# Altium schematic sheet POWER.SchDoc
size A3; SheetNumber: 4; SheetTotal: 5
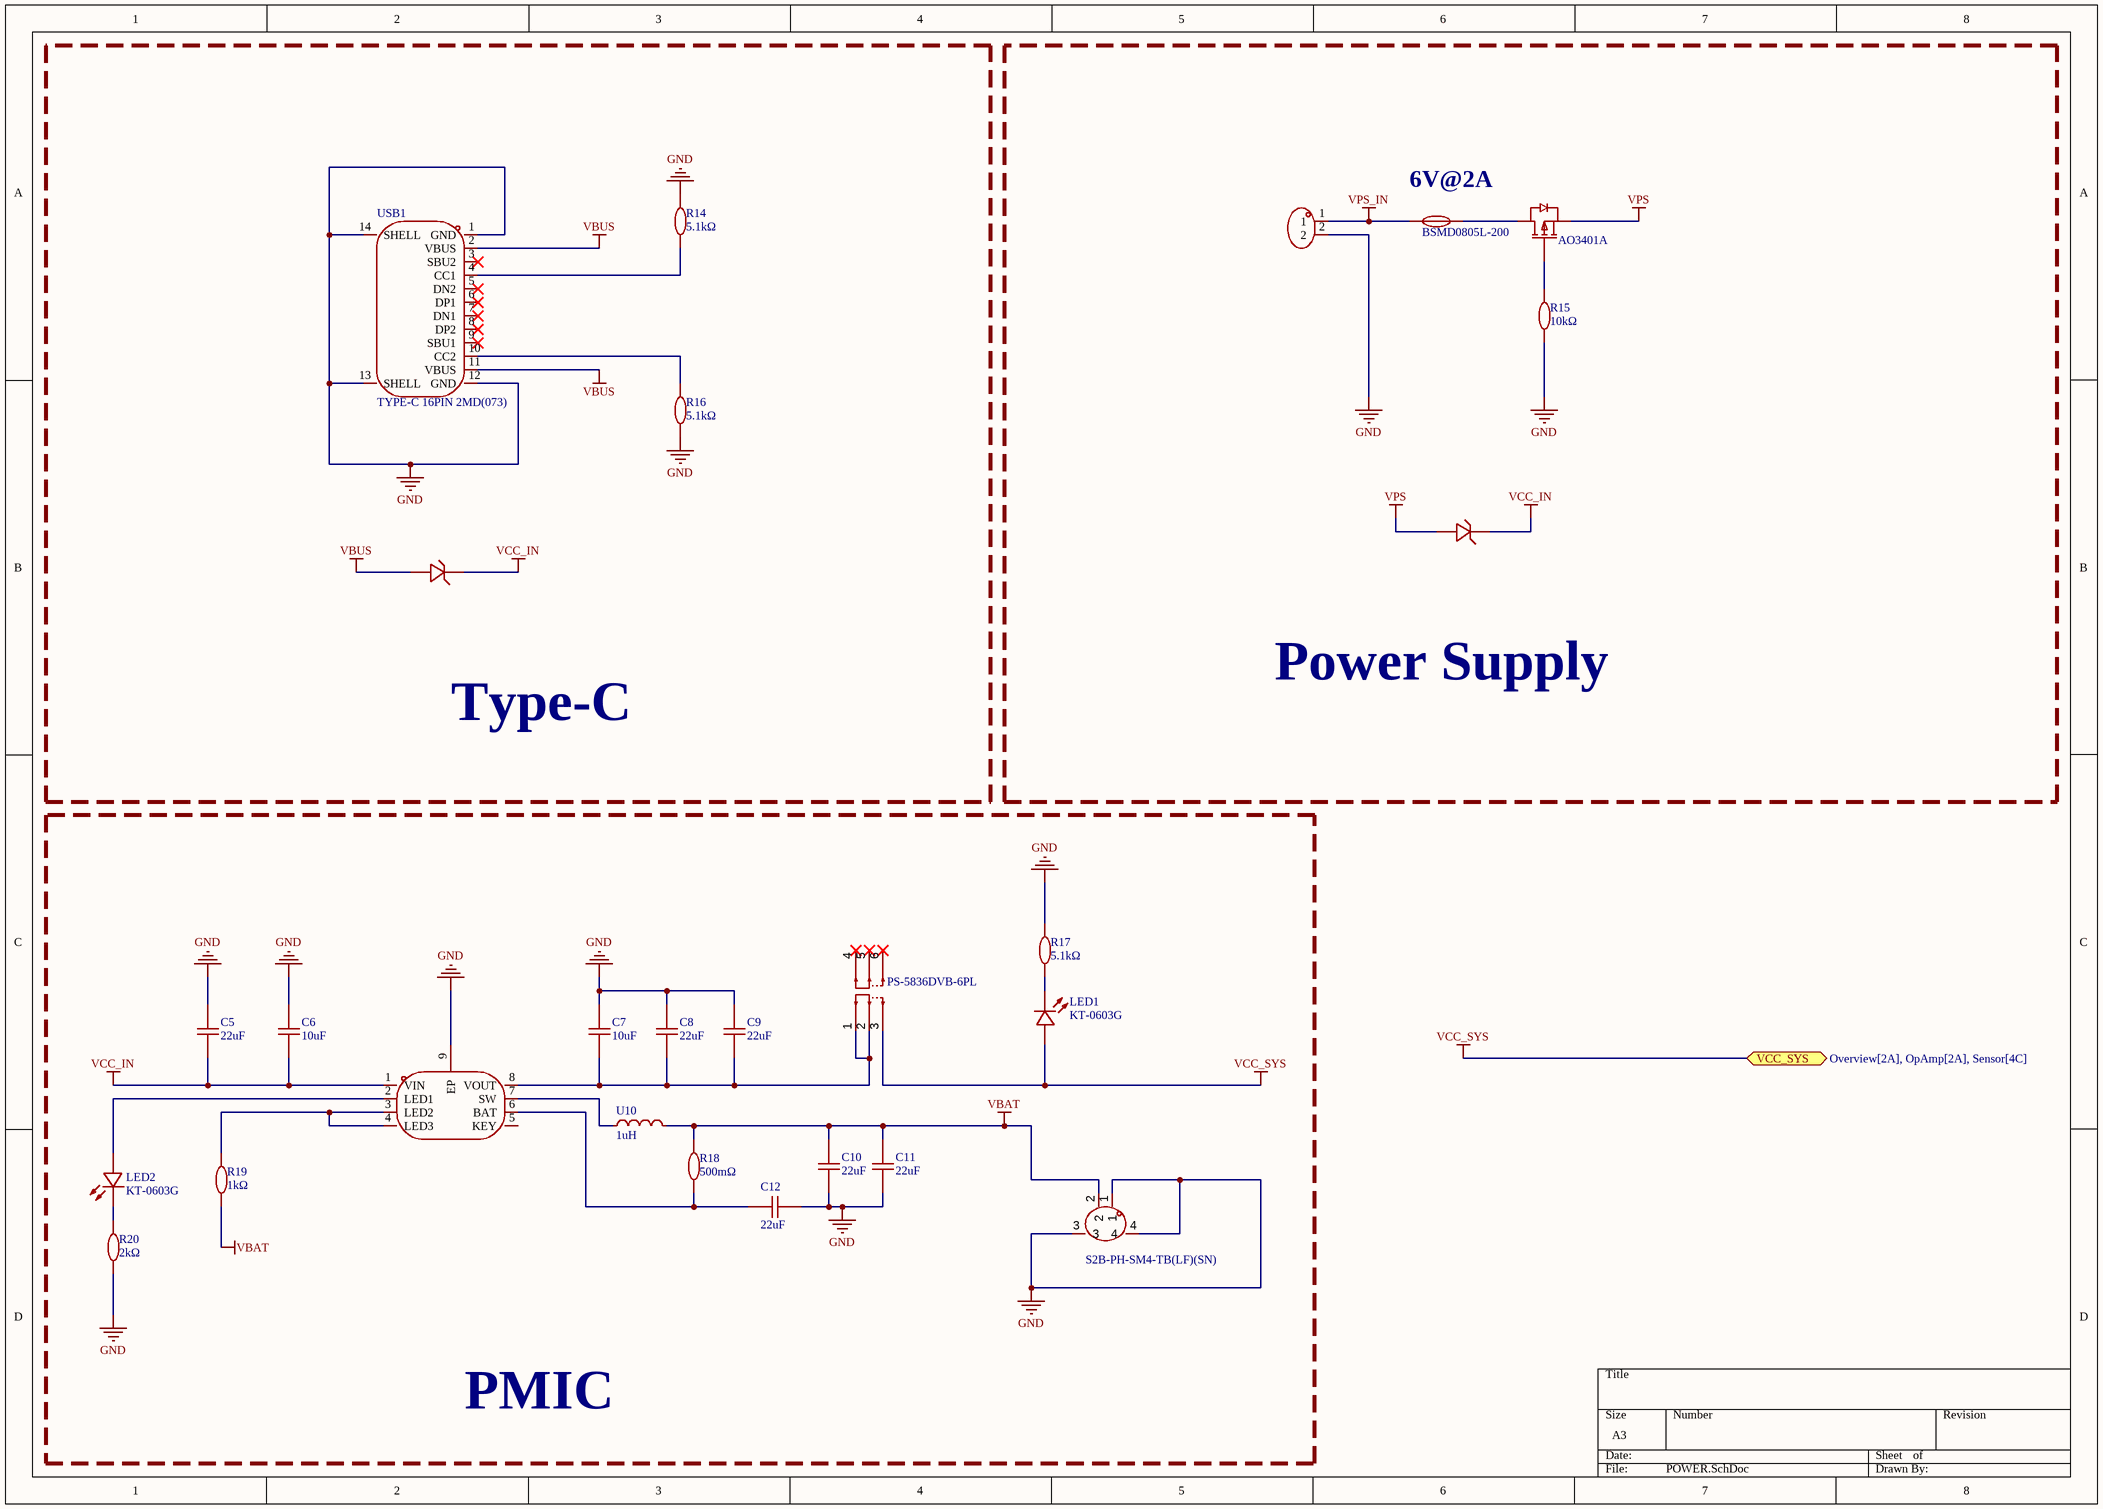
[diagram p0: POWER.SchDoc]

## Parts
C5  22uF  [C0603]
C6  10uF  [C0603]
C7  10uF  [C0603]
C8  22uF  [C0603]
C9  22uF  [C0603]
C10  22uF  [C0603]
C11  22uF  [C0603]
C12  22uF  [C0603]
CN1  S2B-PH-SM4-TB(LF)(SN)  [CONN-SMD_P2.00_S2B-PH-SM4-TB-LF-SN]
D1  DSK24  [SOD-123FL_L2.7-W1.8-LS3.8-RD]  (value not drawn)
D2  DSK24  [SOD-123FL_L2.7-W1.8-LS3.8-RD]  (value not drawn)
F1  BSMD0805L-200  [F0805]
LED1  KT-0603G  [LED0603-GR]
LED2  KT-0603G  [LED0603-GR]
Q3  AO3401A  [SOT-23_L2.9-W1.3-P1.90-LS2.4-BR]
R14  5.1kΩ  [R0402]
R15  10kΩ  [R0402]
R16  5.1kΩ  [R0402]
R17  5.1kΩ  [R0402]
R18  500mΩ  [R0402]
R19  1kΩ  [R0402]
R20  2kΩ  [R0402]
U9  PS-5836DVB-6PL  [SW-TH_6P-L5.8-W5.8-P2.00-LS4.5-BL]
U10  1uH  [IND-SMD_L2.5-W2.0_WPN252012H]
U11  IP5306  [ESOP-8_L4.9-W3.9-P1.27-LS6.0-BL-EP]  (value not drawn)
U?  HX PZ2.54-1x2P ZZ  [HDR-TH_2P-P2.54-V-M-3]  (value not drawn)
USB1  TYPE-C 16PIN 2MD(073)  [USB-C-SMD_TYPE-C-6PIN-2MD-073]

## Blocks framed on the sheet
Type-C: D2 R14 R16 USB1
Power Supply: D1 F1 Q3 R15 U?
PMIC: C5-C12 CN1 LED1 LED2 R17-R20 U9-U11

## Ports
VCC_SYS (bidir, see Overview[2A], OpAmp[2A], Sensor[4C])

## Nets
GND: C5.2 C6.2 C7.2 C8.2 C9.2 C10.1 C11.1 C12.1 CN1.1 CN1.3 CN1.4 R14.2 R15.1 R16.1 R17.2 R20.1 U11.9(EP) U?.2 USB1.1(GND) USB1.12(GND) USB1.13(SHELL) USB1.14(SHELL)
VBAT: C10.2 C11.2 CN1.2 R18.2 R19.1 U10.2
VBUS: D2.2(A) USB1.2(VBUS) USB1.11(VBUS)
VCC_IN: C5.1 C6.1 D1.1(C) D2.1(C) U11.1(VIN)
VCC_SYS: LED1.2(A) U9.3 ; port VCC_SYS
VPS: D1.2(A) Q3.2(S)
VPS_IN: F1.1 U?.1
NetC7_1: C7.1 C8.1 C9.1 U9.1 U9.2 U11.8(VOUT)
NetC12_2: C12.2 R18.1 U11.6(BAT)
NetF1_2: F1.2 Q3.3(D)
NetLED1_1: LED1.1(K) R17.1
NetLED2_1: LED2.1(K) R20.2
NetLED2_2: LED2.2(A) U11.2(LED1)
NetQ3_1: Q3.1(G) R15.2
NetR14_1: R14.1 USB1.4(CC1)
NetR16_2: R16.2 USB1.10(CC2)
NetR19_2: R19.2 U11.3(LED2) U11.4(LED3)
NetU10_1: U10.1 U11.7(SW)

Not connected (* = marked no-connect by the designer): U9 4* 5* 6*; U11 5(KEY); USB1 3(SBU2)* 5(DN2)* 6(DP1)* 7(DN1)* 8(DP2)* 9(SBU1)*

## Notes on the sheet
- (near F1) 6V@2A

## Library data of the parts
C5 C8-C12 = 22uF: 16V 22uF X5R ±20% 0603 Ceramic Capacitors ROHS
C6 C7 = 10uF: 10V 10uF X5R ±10% 0603 Ceramic Capacitors ROHS
CN1 = S2B-PH-SM4-TB(LF)(SN): 1x2P 间距:2mm 卧贴 系列:PH; Symbol: S2B-PH-SM4-TB(LF)(SN)
D1 D2 = DSK24: 电压:40V 电流:2A; Manufacturer: Littelfuse(美国力特); Manufacturer Part: SMAJ5.0A; Symbol: SMAJ5.0A-C83329; Device: SMAJ5.0A_C83329; Add into BOM: yes; Polarity: Unidirectional; Reverse Stand-Off Voltage (Vrwm): 5V; Clamping Voltage: 9.2V; Peak Pulse Current (Ipp): 43.5A; Peak Pulse Power Dissipation (Ppp): 400W; Voltage - Breakdown: 6.4V; Reverse Leakage Current (Ir): 800uA; Type: TVS; LCSC Part Name: 耐压/V 5V-440V 峰值脉冲功率 400W; Supplier Part: C83329; Supplier Footprint: DO-214AC(SMA); JLCPCB Part Class: Extended Part; Datasheet: https://item.szlcsc.com/datasheet/SMAJ5.0A/84493.html; Supplier: LCSC; Convert to PCB: yes; Operating Temperature: -65℃~+150℃
F1 = BSMD0805L-200: 6V 2A 0805自恢复; Symbol: BSMD0805L-200
LED1 LED2 = KT-0603G: Green 0603 LED Indication - Discrete ROHS
Q3 = AO3401A: 1个P沟道 耐压:30V 电流:4A; Symbol: AO3401A
R14 R16 R17 = 5.1kΩ: 5.1kΩ 62.5mW 50V ±100ppm/℃ Thick Film Resistor ±1% 0402 Chip Resistor - Surface Mount ROHS
R15 = 10kΩ: 62.5mW 10kΩ 50V ±100ppm/℃ Thick Film Resistor ±1% 0402 Chip Resistor - Surface Mount ROHS
R18 R19 = 1kΩ: 1kΩ 62.5mW 50V ±100ppm/℃ Thick Film Resistor ±1% 0402 Chip Resistor - Surface Mount ROHS
R20 = 2kΩ: 100mW 2kΩ 75V ±100ppm/℃ Thick Film Resistor ±1% 0402 Chip Resistor - Surface Mount ROHS
U9 = PS-5836DVB-6PL: 高头斜柄自锁,行程1.0mm,按动力250gf; Symbol: PS-5836DVB-6PL
U10 = WPN252012H1R0MT
U11 = IP5306: 集成2.1A充电器和2.1A放电器的全集成移动电源系统级芯片; Manufacturer: INJOINIC(英集芯); Add into BOM: yes; Symbol: IP5306; Device: IP5306; LCSC Part Name: IP5306; Supplier Part: C181692; Manufacturer Part: IP5306; Supplier Footprint: ESOP-8; JLCPCB Part Class: Extended Part; Datasheet: https://atta.szlcsc.com/upload/public/pdf/source/20190627/C384572_9925B3DDC4041BC6108E5AB46A2A0AB1.pdf; Supplier: LCSC; Convert to PCB: yes
U? = HX PZ2.54-1x2P ZZ: Manufacturer: hanxia(韩下); Add into BOM: yes; Pin Structure: 1x2P; Pitch: 2.54mm; Circluar Pins/Square Pins: Pin Header; Current Rating: 3A; Symbol: HX PZ2.54-1X2P ZZ; Device: HX PZ2.54-1x2P ZZ; LCSC Part Name: 1x2P 间距:2.54mm 方针 直插; Supplier Part: C32713268; Manufacturer Part: HX PZ2.54-1x2P ZZ; Supplier Footprint: 插件,P=2.54mm; JLCPCB Part Class: Extended Part; Datasheet: https://item.szlcsc.com/datasheet/HX%2520PZ2.54-1x2P%2520ZZ/34444548.html; Supplier: LCSC; Convert to PCB: yes; Row Spacing: -; Mounting Type: Through Hole; Number of Rows: 1; Number of Pins: 2P; Voltage Rating (Max): -; Length of Mating Pin: 6mm; Insulation Height: 2.5mm; Length of End Connection Pin: 3mm; Contact Material: Brass; Contact Plating: Gold; Operating Temperature: -40℃~+105℃; Color: Black
USB1 = TYPE-C 16PIN 2MD(073): 16pin type-c